# Altium schematic sheet dimmer.SchDoc
size A4
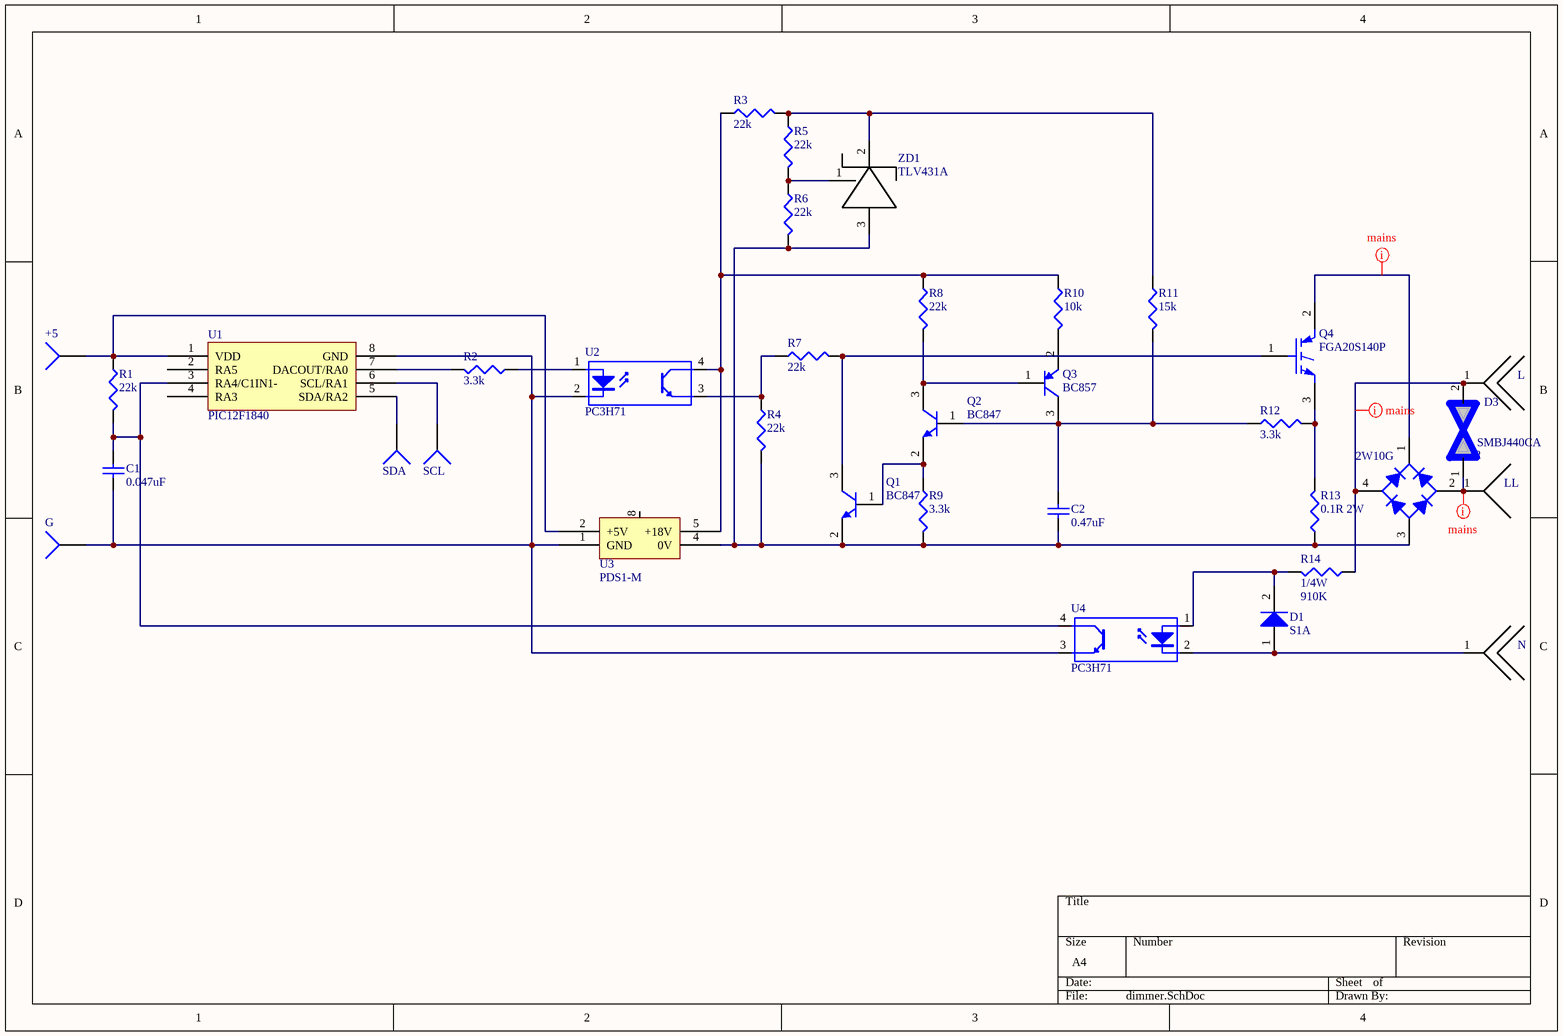
[diagram p0: dimmer.SchDoc]

## Parts
+5  Socket  [PIN1]  (value not drawn)
C1  0.047uF  [1608[0603]]
C2  0.47uF  [1608[0603]]
D1  S1A  [DO-214AC]
D2  2W10G  [2W10G]
D3  SMBJ440CA  [DO-214AA]
G  Socket  [PIN1]  (value not drawn)
L  PWRCON2X  [MAINSPIN2x]  (value not drawn)
LL  PWRCON  [MAINSPIN1]  (value not drawn)
N  PWRCON2X  [MAINSPIN3x]  (value not drawn)
Q1  BC847  [SOT-23_N]
Q2  BC847  [SOT-23_N]
Q3  BC857  [SOT-23_N]
Q4  FGA20S140P  [FGA20S140P]
R1  22k  [J1-0603]
R2  3.3k  [J1-0603]
R3  22k  [J1-0603]
R4  22k  [J1-0603]
R5  22k  [J1-0603]
R6  22k  [J1-0603]
R7  22k  [J1-0603]
R8  22k  [J1-0603]
R9  3.3k  [J1-0603]
R10  10k  [J1-0603]
R11  15k  [J1-0603]
R12  3.3k  [J1-0603]
R13  0.1R 2W  [R2512]
R14  1/4W  value 910K  [R1206]
SCL  Socket  [PIN1]  (value not drawn)
SDA  Socket  [PIN1]  (value not drawn)
U1  PIC12F1840  [SOIC150-8_N]
U2  PC3H71  [PC3H71]
U3  PDS1-M  [PDS1-M]
U4  PC3H71  [PC3H71]
ZD1  TLV431A  [SOT-23_N]

## Nets
Net+5_1: +5.1 R1.1 U1.1(VDD) U3.2(+5V)
NetC1_1: C1.1 G.1 U1.8(GND) U2.2(K) U3.1(GND) U4.3(E)
NetC1_2: C1.2 R1.2 U1.3(RA4/C1IN1-) U4.4(C)
NetC2_1: C2.1 D2.3(A) Q1.2(E) R4.2 R6.2 R9.2 R13.1 U3.4(0V) ZD1.3
NetC2_2: C2.2 Q2.1(B) Q3.3(C) R11.2 R12.1
NetD1_1: D1.1(A) N.1 U4.2(K)
NetD1_2: D1.2(K) R14.2 U4.1(A)
NetD2_1: D2.1(K) Q4.2(C)
NetD2_2: D2.2(C) D3.1 LL.1
NetD2_4: D2.4(C) D3.2 L.1 R14.1
NetQ1_1: Q1.1(B) Q2.2(E) R9.1
NetQ1_3: Q1.3(C) Q4.1(G) R7.2
NetQ2_3: Q2.3(C) Q3.1(B) R8.2
NetQ3_2: Q3.2(E) R10.2
NetQ4_3: Q4.3(E) R12.2 R13.2
NetR2_1: R2.1 U2.1(A)
NetR2_2: R2.2 U1.7(DACOUT/RA0)
NetR3_1: R3.1 R8.1 R10.1 U2.4(C) U3.5(+18V)
NetR3_2: R3.2 R5.1 R11.1 ZD1.2
NetR4_1: R4.1 R7.1 U2.3(E)
NetR5_2: R5.2 R6.1 ZD1.1
NetSCL_1: SCL.1 U1.6(SCL/RA1)
NetSDA_1: SDA.1 U1.5(SDA/RA2)

Not connected (* = marked no-connect by the designer): U1 2(RA5) 4(RA3); U3 8

## Layout directives
net class mains: NetD2_1, NetD2_2, NetD2_4

## Library data of the parts
C1 C2 = Cap Semi: Capacitor (Semiconductor SIM Model); Published: 8-Jun-2000; LatestRevisionDate: 29-May-2009; LatestRevisionNote: IPC-7351 Footprint Added.; PackageReference: C1206; Publisher: Altium Limited; PackageDescription: Chip Capacitor
  C1: Value: 0.047uF
  C2: Value: 0.47uF
D1 = Diode: Default Diode; Published: 8-Jun-2000; LatestRevisionDate: 17-Jul-2002; LatestRevisionNote: Re-released for DXP Platform.; PackageVersion: Sep-1996; PackageReference: SMC; Publisher: Altium Limited; PackageDescription: DO-214-AB/SMC; 2 C-Bend Leads; Body 7.9 x 5.9 mm, inc. leads (LxW); Code_JEDEC: DO-214-AB
D2 = Bridge1: Full Wave Diode Bridge; Published: 8-Jun-2000; LatestRevisionDate: 29-May-2009; LatestRevisionNote: Sch pins A & K swapped.; DatasheetVersion: E2732B; PackageReference: D-38; Publisher: Altium Limited; PackageDescription: Bridge Rectifier; 4 Terminals; Body 9.4 x 9.4 mm (typ); Pitch 5.08 mm
Q1 Q2 = NPN: NPN Bipolar Transistor; Published: 8-Jun-2000; LatestRevisionDate: 17-Jul-2002; LatestRevisionNote: Re-released for DXP Platform.; PackageReference: TO-226-AA; Publisher: Altium Limited; PackageDescription: TO, Flat Index; 3 In-Line, Axial Leads; Body Dia. 4.8mm; Leads 0.55 x 0.51 mm (max); Code_JEDEC: TO-226-AA
Q3 = PNP: PNP Bipolar Transistor; Published: 8-Jun-2000; LatestRevisionDate: 29-May-2009; LatestRevisionNote: IPC-7351 Footprint Added.; PackageVersion: Aug-1999; PackageReference: SOT-23B; Publisher: Altium Limited; PackageDescription: 3-Pin SOT-23 Package 0.95 mm Pitch, 2.4 mm Lead Span
Q4 = IGBT-N: Insulated Gate Bipolar Transistor (N-Channel); Published: 8-Jun-2000; LatestRevisionDate: 17-Jul-2002; LatestRevisionNote: Re-released for DXP Platform.; DatasheetVersion: PD-9.684A; PackageReference: TO-247; Publisher: Altium Limited; PackageDescription: SIP with Mounting Hole; 3 Leads; Body 20 x 15.6 x 5 mm (typ); Pitch 5.45 mm; Code_JEDEC: TO-247-AC; ComponentLink1Description: Manufacturer Link; ComponentLink1URL: http://www.irf.com/
R1-R12 R14 = Res3: Resistor; Published: 8-Jun-2000; LatestRevisionDate: 29-May-2009; LatestRevisionNote: IPC-7351 Footprint Added.; PackageReference: J1-0603; Publisher: Altium Limited; PackageDescription: Chip Resistor
  R1 R3-R8: Value: 22K
  R2 R9 R12: Value: 3.3K
  R10: Value: 10K
  R11: Value: 15K
R13 = Res3: Resistor; Value: 0.1; Published: 8-Jun-2000; LatestRevisionDate: 29-May-2009; LatestRevisionNote: IPC-7351 Footprint Added.; PackageReference: J1-0603; Publisher: Altium Limited; PackageDescription: Chip Resistor
U2 U4 = Optoisolator1: 4-Pin Phototransistor Optocoupler; Published: 24-Mar-1999; LatestRevisionDate: 04-Mar-2005; LatestRevisionNote: Sch pins 3 & 4 Swapped.; DatasheetVersion: Nov-2003; PackageReference: DIP-4; Publisher: Altium Limited
+5 G SCL SDA = Socket: LatestRevisionDate: 17-Jul-2002; LatestRevisionNote: Re-released for DXP Platform.; Publisher: Altium Limited